# EAGLE design Universal-Sensor_Atmega328-v05 (EAGLE 7.3.0)
Assembly variants: Atmega + TH, P, L, Max (RF), Atmega + TH, P, MAX (RF), Atmega + TH, L, MAX (RF), Atmega + TH, MAX (RF), Atmega + TH, P, L, (Wired)
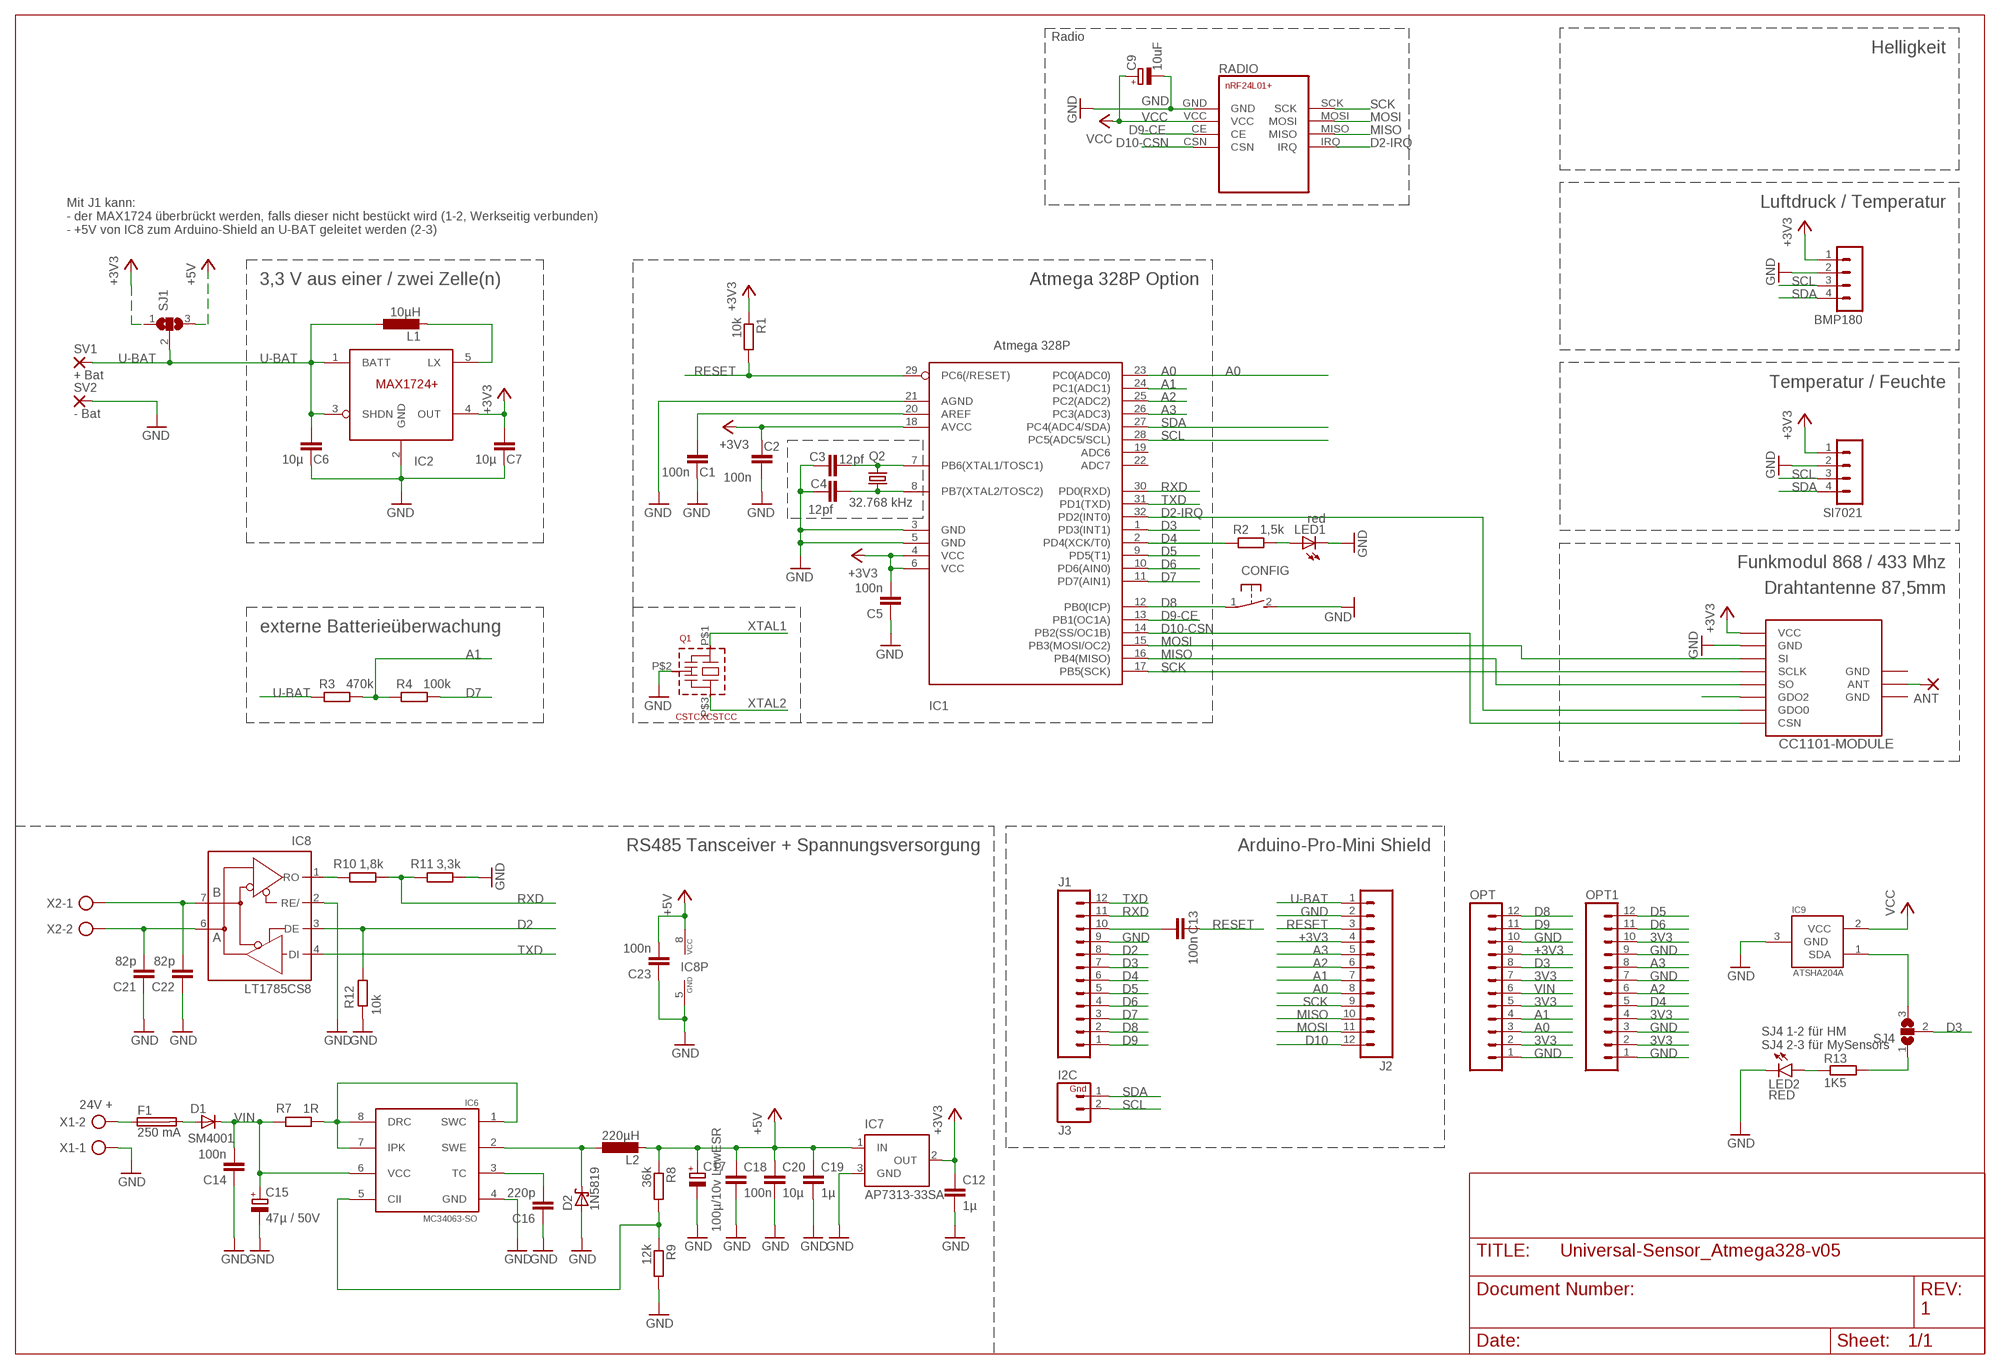
[diagram p0: schematic, sheet 1]

## Parts
ANT  1,6/0,8  [1,6/0,8]  (not fitted in variant Atmega + TH, P, L, (Wired))
BMP180  MA04-1  [MA04-1]
C1  100n  C-EUC0805  [C0805]
C2  100n  C-EUC0805  [C0805]
C3  12pf  C-EUC0805  [C0805]  (not fitted in variant Atmega + TH, P, L, Max (RF))  (not fitted in variant Atmega + TH, P, MAX (RF))  (not fitted in variant Atmega + TH, L, MAX (RF))  (not fitted in variant Atmega + TH, MAX (RF))  (not fitted in variant Atmega + TH, P, L, (Wired))
C4  12pf  C-EUC0805  [C0805]  (not fitted in variant Atmega + TH, P, L, Max (RF))  (not fitted in variant Atmega + TH, P, MAX (RF))  (not fitted in variant Atmega + TH, L, MAX (RF))  (not fitted in variant Atmega + TH, MAX (RF))  (not fitted in variant Atmega + TH, P, L, (Wired))
C5  100n  C-EUC0805  [C0805]
C6  10µ  C-EUC1206  [C1206]  (not fitted in variant Atmega + TH, P, L, (Wired))
C7  10µ  C-EUC1206  [C1206]  (not fitted in variant Atmega + TH, P, L, (Wired))
C9  10uF  CPOL-EUE2,5-6E  [E2,5-6E]
C12  1µ  C-EUC0805  [C0805]  (not fitted in variant Atmega + TH, P, L, Max (RF))  (not fitted in variant Atmega + TH, P, MAX (RF))  (not fitted in variant Atmega + TH, L, MAX (RF))  (not fitted in variant Atmega + TH, MAX (RF))
C13  100n  C-EUC0805  [C0805]
C14  100n  C-EUC1206  [C1206]  (not fitted in variant Atmega + TH, P, L, Max (RF))  (not fitted in variant Atmega + TH, P, MAX (RF))  (not fitted in variant Atmega + TH, L, MAX (RF))  (not fitted in variant Atmega + TH, MAX (RF))
C15  47µ / 50V  CPOL-EUE2.5-7  [E2,5-7]  (not fitted in variant Atmega + TH, P, L, Max (RF))  (not fitted in variant Atmega + TH, P, MAX (RF))  (not fitted in variant Atmega + TH, L, MAX (RF))  (not fitted in variant Atmega + TH, MAX (RF))
C16  220p  C-EUC0805  [C0805]  (not fitted in variant Atmega + TH, P, L, Max (RF))  (not fitted in variant Atmega + TH, P, MAX (RF))  (not fitted in variant Atmega + TH, L, MAX (RF))  (not fitted in variant Atmega + TH, MAX (RF))
C17  100µ/10v LowESR  CPOL-EUSMCD  [SMC_D]  (not fitted in variant Atmega + TH, P, L, Max (RF))  (not fitted in variant Atmega + TH, P, MAX (RF))  (not fitted in variant Atmega + TH, L, MAX (RF))  (not fitted in variant Atmega + TH, MAX (RF))
C18  100n  C-EUC0805  [C0805]  (not fitted in variant Atmega + TH, P, L, Max (RF))  (not fitted in variant Atmega + TH, P, MAX (RF))  (not fitted in variant Atmega + TH, L, MAX (RF))  (not fitted in variant Atmega + TH, MAX (RF))
C19  1µ  C-EUC0805  [C0805]  (not fitted in variant Atmega + TH, P, L, Max (RF))  (not fitted in variant Atmega + TH, P, MAX (RF))  (not fitted in variant Atmega + TH, L, MAX (RF))  (not fitted in variant Atmega + TH, MAX (RF))
C20  10µ  C-EUC1206  [C1206]  (not fitted in variant Atmega + TH, P, L, Max (RF))  (not fitted in variant Atmega + TH, P, MAX (RF))  (not fitted in variant Atmega + TH, L, MAX (RF))  (not fitted in variant Atmega + TH, MAX (RF))
C21  82p  C-EUC0805  [C0805]  (not fitted in variant Atmega + TH, P, L, Max (RF))  (not fitted in variant Atmega + TH, P, MAX (RF))  (not fitted in variant Atmega + TH, L, MAX (RF))  (not fitted in variant Atmega + TH, MAX (RF))
C22  82p  C-EUC0805  [C0805]  (not fitted in variant Atmega + TH, P, L, Max (RF))  (not fitted in variant Atmega + TH, P, MAX (RF))  (not fitted in variant Atmega + TH, L, MAX (RF))  (not fitted in variant Atmega + TH, MAX (RF))
C23  100n  C-EUC0805  [C0805]  (not fitted in variant Atmega + TH, P, L, Max (RF))  (not fitted in variant Atmega + TH, P, MAX (RF))  (not fitted in variant Atmega + TH, L, MAX (RF))  (not fitted in variant Atmega + TH, MAX (RF))
CC1101-MODULE  CC1101_WIRELES_MODULE  [CC1101_WIRELES_MODULE]  (not fitted in variant Atmega + TH, P, L, (Wired))
CONFIG  DTSM-3  [DTSM-3]
D1  SM4001  DIODE-MELF-MLL41  [MELF-MLL41]  (not fitted in variant Atmega + TH, P, L, Max (RF))  (not fitted in variant Atmega + TH, P, MAX (RF))  (not fitted in variant Atmega + TH, L, MAX (RF))  (not fitted in variant Atmega + TH, MAX (RF))
D2  1N5819  SCHOTTKY-DIODESMD  [SMB]  (not fitted in variant Atmega + TH, P, L, Max (RF))  (not fitted in variant Atmega + TH, P, MAX (RF))  (not fitted in variant Atmega + TH, L, MAX (RF))  (not fitted in variant Atmega + TH, MAX (RF))
F1  250 mA  SMD-MICRO-FUSE  [SMD-6,1X2,6]  (not fitted in variant Atmega + TH, P, L, Max (RF))  (not fitted in variant Atmega + TH, P, MAX (RF))  (not fitted in variant Atmega + TH, L, MAX (RF))  (not fitted in variant Atmega + TH, MAX (RF))
IC1  Atmega 328P  MEGA8-AI  [TQFP32-08]
IC2  MAX1724  [SOT23-5L]  (not fitted in variant Atmega + TH, P, L, (Wired))
IC6  MC34063-SO  [SO8]  (not fitted in variant Atmega + TH, P, L, Max (RF))  (not fitted in variant Atmega + TH, P, MAX (RF))  (not fitted in variant Atmega + TH, L, MAX (RF))  (not fitted in variant Atmega + TH, MAX (RF))
IC7  AP7313-33SA  MAX6520  [SOT23]  (not fitted in variant Atmega + TH, P, L, Max (RF))  (not fitted in variant Atmega + TH, P, MAX (RF))  (not fitted in variant Atmega + TH, L, MAX (RF))  (not fitted in variant Atmega + TH, MAX (RF))  (not fitted in variant Atmega + TH, P, L, (Wired))
IC8  LT1785CS8  MAX481CSA  [SO08]  (not fitted in variant Atmega + TH, P, L, Max (RF))  (not fitted in variant Atmega + TH, P, MAX (RF))  (not fitted in variant Atmega + TH, L, MAX (RF))  (not fitted in variant Atmega + TH, MAX (RF))
IC9  ATSHA204A  IC_ATSHA204A_CRYPT  [SOT23-3]
J1  M12PTH  [1X12]  (not fitted in variant Atmega + TH, P, L, Max (RF))  (not fitted in variant Atmega + TH, P, MAX (RF))  (not fitted in variant Atmega + TH, L, MAX (RF))  (not fitted in variant Atmega + TH, MAX (RF))  (not fitted in variant Atmega + TH, P, L, (Wired))
J2  M12PTH  [1X12]  (not fitted in variant Atmega + TH, P, L, Max (RF))  (not fitted in variant Atmega + TH, P, MAX (RF))  (not fitted in variant Atmega + TH, L, MAX (RF))  (not fitted in variant Atmega + TH, MAX (RF))  (not fitted in variant Atmega + TH, P, L, (Wired))
J3  I2C  M02PTH  [1X02]  (not fitted in variant Atmega + TH, P, L, Max (RF))  (not fitted in variant Atmega + TH, P, MAX (RF))  (not fitted in variant Atmega + TH, L, MAX (RF))  (not fitted in variant Atmega + TH, MAX (RF))  (not fitted in variant Atmega + TH, P, L, (Wired))
L1  10µH  L-EUL4532P  [L4532P]  (not fitted in variant Atmega + TH, P, L, (Wired))
L2  220µH  L-EUL5650M  [L5650M]  (not fitted in variant Atmega + TH, P, L, Max (RF))  (not fitted in variant Atmega + TH, P, MAX (RF))  (not fitted in variant Atmega + TH, L, MAX (RF))  (not fitted in variant Atmega + TH, MAX (RF))
LED1  red  LEDCHIP-LED0805  [CHIP-LED0805]
LED2  RED  LED-RED1206  [LED-1206]
OPT  M12PTH  [1X12]
OPT1  M12PTH  [1X12]
Q1  CSTCXCSTCC  [CSTCC]  (not fitted in variant Atmega + TH, P, L, Max (RF))  (not fitted in variant Atmega + TH, L, MAX (RF))  (not fitted in variant Atmega + TH, MAX (RF))  (not fitted in variant Atmega + TH, P, MAX (RF))
Q2  32.768 kHz  CRYSTALTC38H  [TC38H]  (not fitted in variant Atmega + TH, P, L, Max (RF))  (not fitted in variant Atmega + TH, P, MAX (RF))  (not fitted in variant Atmega + TH, L, MAX (RF))  (not fitted in variant Atmega + TH, MAX (RF))  (not fitted in variant Atmega + TH, P, L, (Wired))
R1  10k  R-EU_M0805  [M0805]
R2  1,5k  R-EU_M0805  [M0805]
R3  470k  R-EU_M0805  [M0805]  (not fitted in variant Atmega + TH, P, L, (Wired))
R4  100k  R-EU_M0805  [M0805]  (not fitted in variant Atmega + TH, P, L, (Wired))
R7  1R  R-EU_R0805  [R0805]  (not fitted in variant Atmega + TH, P, L, Max (RF))  (not fitted in variant Atmega + TH, P, MAX (RF))  (not fitted in variant Atmega + TH, L, MAX (RF))  (not fitted in variant Atmega + TH, MAX (RF))
R8  36k  R-EU_R0805  [R0805]  (not fitted in variant Atmega + TH, P, L, Max (RF))  (not fitted in variant Atmega + TH, P, MAX (RF))  (not fitted in variant Atmega + TH, L, MAX (RF))  (not fitted in variant Atmega + TH, MAX (RF))
R9  12k  R-EU_R0805  [R0805]  (not fitted in variant Atmega + TH, P, L, Max (RF))  (not fitted in variant Atmega + TH, P, MAX (RF))  (not fitted in variant Atmega + TH, L, MAX (RF))  (not fitted in variant Atmega + TH, MAX (RF))
R10  1,8k  R-EU_R0805  [R0805]  (not fitted in variant Atmega + TH, P, L, Max (RF))  (not fitted in variant Atmega + TH, P, MAX (RF))  (not fitted in variant Atmega + TH, L, MAX (RF))  (not fitted in variant Atmega + TH, MAX (RF))
R11  3,3k  R-EU_R0805  [R0805]  (not fitted in variant Atmega + TH, P, L, Max (RF))  (not fitted in variant Atmega + TH, P, MAX (RF))  (not fitted in variant Atmega + TH, L, MAX (RF))  (not fitted in variant Atmega + TH, MAX (RF))
R12  10k  R-EU_M0805  [M0805]  (not fitted in variant Atmega + TH, P, L, Max (RF))  (not fitted in variant Atmega + TH, P, MAX (RF))  (not fitted in variant Atmega + TH, L, MAX (RF))  (not fitted in variant Atmega + TH, MAX (RF))
R13  1K5  R0805_SMALL_GAP  [R0805_SMALL_GAP]
RADIO  NRF24L01+  [NRF24L01+]
SI7021  MA04-1  [MA04-1]
SJ1  SJ2W  [SJ_2]  (not fitted in variant Atmega + TH, P, L, Max (RF))  (not fitted in variant Atmega + TH, L, MAX (RF))  (not fitted in variant Atmega + TH, MAX (RF))  (not fitted in variant Atmega + TH, P, MAX (RF))
SJ4  SJ2W  [SJ_2]
SV1  + Bat  1,6/0,9  [1,6/0,9]  (not fitted in variant Atmega + TH, P, L, (Wired))
SV2  - Bat  1,6/0,9  [1,6/0,9]  (not fitted in variant Atmega + TH, P, L, (Wired))
X1  AK550/2  [AK550/2]  (not fitted in variant Atmega + TH, P, L, Max (RF))  (not fitted in variant Atmega + TH, P, MAX (RF))  (not fitted in variant Atmega + TH, L, MAX (RF))  (not fitted in variant Atmega + TH, MAX (RF))
X2  AK550/2  [AK550/2]  (not fitted in variant Atmega + TH, P, L, Max (RF))  (not fitted in variant Atmega + TH, P, MAX (RF))  (not fitted in variant Atmega + TH, L, MAX (RF))  (not fitted in variant Atmega + TH, MAX (RF))

## Nets
3V3: OPT1.2 OPT1.4 OPT1.10 OPT.2 OPT.5 OPT.7
+3V3 [vcc]: BMP180.1 C2.2 C5.2 C7.2 C12.1 CC1101-MODULE.VCC IC1.4(VCC) IC1.6(VCC) IC1.18(AVCC) IC2.4(OUT) IC7.2(OUT) J2.4 OPT.9 R1.1 SI7021.1 SJ1.1
+5V [vcc]: C17.+ C18.1 C19.1 C20.1 C23.2 IC7.1(IN) IC8.8(VCC) L2.2 R8.1 SJ1.3
A: C21.2 IC8.6(A) X2.2
A0: IC1.23(PC0(ADC0)) J2.8 OPT.3
A1: IC1.24(PC1(ADC1)) J2.7 OPT.4 R3.2 R4.1
A2: IC1.25(PC2(ADC2)) J2.6 OPT1.6
A3: IC1.26(PC3(ADC3)) J2.5 OPT1.8
ATSHA: IC9.1(SDA) SJ4.3
B: C22.2 IC8.7(B) X2.1
D2: IC8.3(DE) J1.8 R12.2
D2-IRQ: CC1101-MODULE.GDO0 IC1.32(PD2(INT0)) RADIO.IRQ
D3: IC1.1(PD3(INT1)) J1.7 OPT.8 SJ4.2
D4: IC1.2(PD4(XCK/T0)) J1.6 OPT1.5 R2.1
D5: IC1.9(PD5(T1)) J1.5 OPT1.12
D6: IC1.10(PD6(AIN0)) J1.4 OPT1.11
D7: IC1.11(PD7(AIN1)) J1.3 R4.2
D8: CONFIG.1 IC1.12(PB0(ICP)) J1.2 OPT.12
D9: J1.1 OPT.11
D9-CE: IC1.13(PB1(OC1A)) RADIO.CE
D10: J2.12
D10-CSN: CC1101-MODULE.CSN IC1.14(PB2(SS/OC1B)) RADIO.CSN
GND [power]: BMP180.2 C1.1 C2.1 C3.2 C4.2 C5.1 C6.1 C7.1 C9.- C12.2 C14.1 C15.- C16.1 C17.- C18.2 C19.2 C20.2 C21.1 C22.1 C23.1 CC1101-MODULE.GND@1(GND) CONFIG.2 D2.A IC1.3(GND) IC1.5(GND) IC1.21(AGND) IC2.2(GND) IC6.4(GND) IC7.3(GND) IC8.2(RE/) IC8.5(GND) IC9.3(GND) J1.9 J2.2 LED1.C LED2.C OPT1.1 OPT1.3 OPT1.7 OPT1.9 OPT.1 OPT.10 Q1.P$2(GND) R9.2 R11.1 R12.1 RADIO.GND SI7021.2 SV2.1(P) X1.1
LED: R13.2 SJ4.1
MISO: CC1101-MODULE.SO IC1.16(PB4(MISO)) J2.10 RADIO.MISO
MOSI: CC1101-MODULE.SI IC1.15(PB3(MOSI/OC2)) J2.11 RADIO.MOSI
N$1: C13.2 J1.10
N$2: IC2.5(LX) L1.2
N$3: CC1101-MODULE.GDO2
N$4: LED1.A R2.2
N$5: ANT.1(P) CC1101-MODULE.ANT
N$6: LED2.A R13.1
N$9 [vcc]: F1.1 X1.2
N$10: IC8.1(RO) R10.2
N$14: C1.2 IC1.20(AREF)
N$16 [vcc]: D1.A F1.2
N$17: IC6.1(SWC) IC6.7(IPK) IC6.8(DRC) R7.1
N$20: IC6.5(CII) R8.2 R9.1
N$21: C16.2 IC6.3(TC)
N$22 [vcc]: D2.C IC6.2(SWE) L2.1
RESET: C13.1 IC1.29(PC6(/RESET)) J2.3 R1.2
RXD: IC1.30(PD0(RXD)) J1.11 R10.1 R11.2
SCK: CC1101-MODULE.SCLK IC1.17(PB5(SCK)) J2.9 RADIO.SCK
SCL: BMP180.3 IC1.28(PC5(ADC5/SCL)) J3.2 SI7021.3
SDA: BMP180.4 IC1.27(PC4(ADC4/SDA)) J3.1 SI7021.4
TXD: IC1.31(PD1(TXD)) IC8.4(DI) J1.12
U-BAT [power]: C6.2 IC2.1(BATT) IC2.3(SHDN) J2.1 L1.1 R3.1 SJ1.2 SV1.1(P)
VCC: C9.+ IC9.2(VCC) RADIO.VCC
VIN [vcc]: C14.2 C15.+ D1.C IC6.6(VCC) OPT.6 R7.2
XTAL1: C3.1 IC1.7(PB6(XTAL1/TOSC1)) Q1.P$1 Q2.2
XTAL2: C4.1 IC1.8(PB7(XTAL2/TOSC2)) Q1.P$3 Q2.1
Unconnected: IC1.19(ADC6) IC1.22(ADC7)

## Notes on the sheet
- Radio
- Helligkeit
- Luftdruck / Temperatur
- Mit J1 kann:
  - der MAX1724 überbrückt werden, falls dieser nicht bestückt wird (1-2, Werkseitig verbunden)
  - +5V von IC8 zum Arduino-Shield an U-BAT geleitet werden (2-3)
- 3,3 V aus einer / zwei Zelle(n) | Atmega 328P Option
- Temperatur / Feuchte
- IC2
- Funkmodul 868 / 433 Mhz
- Drahtantenne 87,5mm
- externe Batterieüberwachung
- RS485 Tansceiver + Spannungsversorgung | Arduino-Pro-Mini Shield
- SJ4 1-2 für HM
  SJ4 2-3 für MySensors
- 24V +
- 1

## Power pins joined to a net without a drawn wire
GND: CC1101-MODULE.GND@2(GND) CC1101-MODULE.GND@3(GND)

## Library data of the parts
ANT = wirepad:1,6/0,8: THROUGH-HOLE PAD
BMP180 SI7021 = con-lstb:MA04-1: PIN HEADER; OC_FARNELL: unknown; OC_NEWARK: unknown
C1-C7 C12-C14 C16 C18-C23 = rcl:C-EU: CAPACITOR, European symbol
C9 C15 C17 = rcl:CPOL-EU: POLARIZED CAPACITOR, European symbol
CC1101-MODULE = untitled:CC1101_WIRELES_MODULE
CONFIG = switch-tact:DTSM-3
D1 = diode:DIODE-: DIODE
D2 = diode:SCHOTTKY-DIODE: Schottky Diode
F1 = f-lf-omniblok-s:SMD-MICRO-FUSE
IC1 = atmel:MEGA8: MICROCONTROLLER 8 Kbytes FLASH 1 kbytes SRAM 512 bytes EEPROM USART 6-channel 10 bit ADC 2-channel 8 bit ADC
IC2 = MAX1724:MAX1724
IC6 = mc34063:MC34063-SO: DC/DC converter MC34063 in SO08.
IC7 = maxim:MAX6520: 1.2V Voltage Reference 50ppm/°C, SOT23, 3-Terminal Source: Data sheet <http://datasheets.maxim-ic.com/en/ds/MAX6520.pdf>; MF: MAXIM; MPN: MAX6520EUR-T; OC_FARNELL: unknown; OC_NEWARK: 02J4586
IC8 = maxim:MAX481CSA: RS485 TRANSEIVER; MF: MAXIM; MPN: MAX481CSA; OC_FARNELL: unknown; OC_NEWARK: 90C3817
IC9 = MySensors:IC_ATSHA204A_CRYPT
J1 J2 OPT OPT1 = SparkFun:M12: Header 12 Standard 12-pin 0.1" header. Use with straight break away headers (SKU : PRT-00116), right angle break away headers (PRT-00553), swiss pins (PRT-00743), machine pins (PRT-00117), and female headers (PRT-00115).
J3 = SparkFun:M02: Header 2 Standard 2-pin 0.1" header. Use with straight break away headers (SKU : PRT-00116), right angle break away headers (PRT-00553), swiss pins (PRT-00743), machine pins (PRT-00117), and female headers (PRT-00115). Molex polarized connector foot print use with SKU : PRT-08233 with associated crimp pins and housings.
L1 L2 = rcl:L-EU: INDUCTOR, European symbol
LED1 = led:LED: LED OSRAM: - CHIPLED LG R971, LG N971, LY N971, LG Q971, LY Q971, LO R971, LY R971 LH N974, LH R974 LS Q976, LO Q976, LY Q976 LO Q996 - Hyper CHIPLED LW Q18S LB Q993, LB Q99A, LB R99A - SideLED LS A670, LO A670, LY A670, LG A670, LP A670 LB A673, LV A673, LT A673, LW A673 LH A674 LY A675 LS A676, LA A676, LO A676, LY A676, LW A676 LS A679, LY A679, LG A679 - Hyper Micro SIDELED® LS Y876, LA Y876, LO Y876, LY Y876 LT Y87S - SmartLED LW L88C, LW L88S LB L89C, LB L89S, LG L890 LS L89K, LO L89K, LY L89K LS L896, LA L896, LO L896, LY L896 - TOPLED LS T670, LO T670, LY T670, LG T670, LP T670 LSG T670, LSP T670, LSY T670, LOP T670, LYG T670 LG T671, LOG T671, LSG T671 LB T673, LV T673, LT T673, LW T673 LH T674 LS T676, LA T676, LO T676, LY T676, LB T676, LH T676, LSB T676, LW T676 LB T67C, LV T67C, LT T67C, LS T67K, LO T67K, LY T67K, LW E67C LS E67B, LA E67B, LO E67B, LY E67B, LB E67C, LV E67C, LT E67C LW T67C LS T679, LY T679, LG T679 LS T770, LO T770, LY T770, LG T770, LP T770 LB T773, LV T773, LT T773, LW T773 LH T774 LS E675, LA E675, LY E675, LS T675 LS T776, LA T776, LO T776, LY T776, LB T776 LHGB T686 LT T68C, LB T68C - Hyper Mini TOPLED® LB M676 - Mini TOPLED Santana® LG M470 LS M47K, LO M47K, LY M47K Source: http://www.osram.convergy.de LUXEON: - LUMILED® LXK2-PW12-R00, LXK2-PW12-S00, LXK2-PW14-U00, LXK2-PW14-V00 LXK2-PM12-R00, LXK2-PM12-S00, LXK2-PM14-U00 LXK2-PE12-Q00, LXK2-PE12-R00, LXK2-PE12-S00, LXK2-PE14-T00, LXK2-PE14-U00 LXK2-PB12-K00, LXK2-PB12-L00, LXK2-PB12-M00, LXK2-PB14-N00, LXK2-PB14-P00, LXK2-PB14-Q00 LXK2-PR12-L00, LXK2-PR12-M00, LXK2-PR14-Q00, LXK2-PR14-R00 LXK2-PD12-Q00, LXK2-PD12-R00, LXK2-PD12-S00 LXK2-PH12-R00, LXK2-PH12-S00 LXK2-PL12-P00, LXK2-PL12-Q00, LXK2-PL12-R00 Source: www.luxeon.com KINGBRIGHT: KA-3528ASYC Source: www.kingbright.com
LED2 = SparkFun-LED:LED-RED: Assorted Red LEDs LilyPad 1206- DIO-09912 1206- DIO-00809 0603- DIO-00819 "SMART" means more efficient and expensive; PROD_ID: DIO-09912
Q1 = murata-cstcc-cstcv-resonators:CSTCX
Q2 = crystal:CRYSTAL: CRYSTAL; OC_FARNELL: unknown; OC_NEWARK: unknown
R1-R4 R7-R12 = rcl:R-EU_: RESISTOR, European symbol
R13 = Hexenmeister:R0805_SMALL_GAP: SMD Resistor (0805) mit einer schmalleren Lücke (kann als Lötjumper erwendet werden)
RADIO = my:NRF24L01+: nRF24L01+ Transceiver Module
SJ1 SJ4 = jumper:SJ2W: SMD solder JUMPER
SV1 SV2 = wirepad:1,6/0,9: THROUGH-HOLE PAD
X1 X2 = con-ptr500:AK550/2: CONNECTOR; OC_FARNELL: unknown; OC_NEWARK: unknown

## Net classes
0 default: width 0.203 mm
1 vcc: width 0.305 mm
2 power: width 0.406 mm

## Board
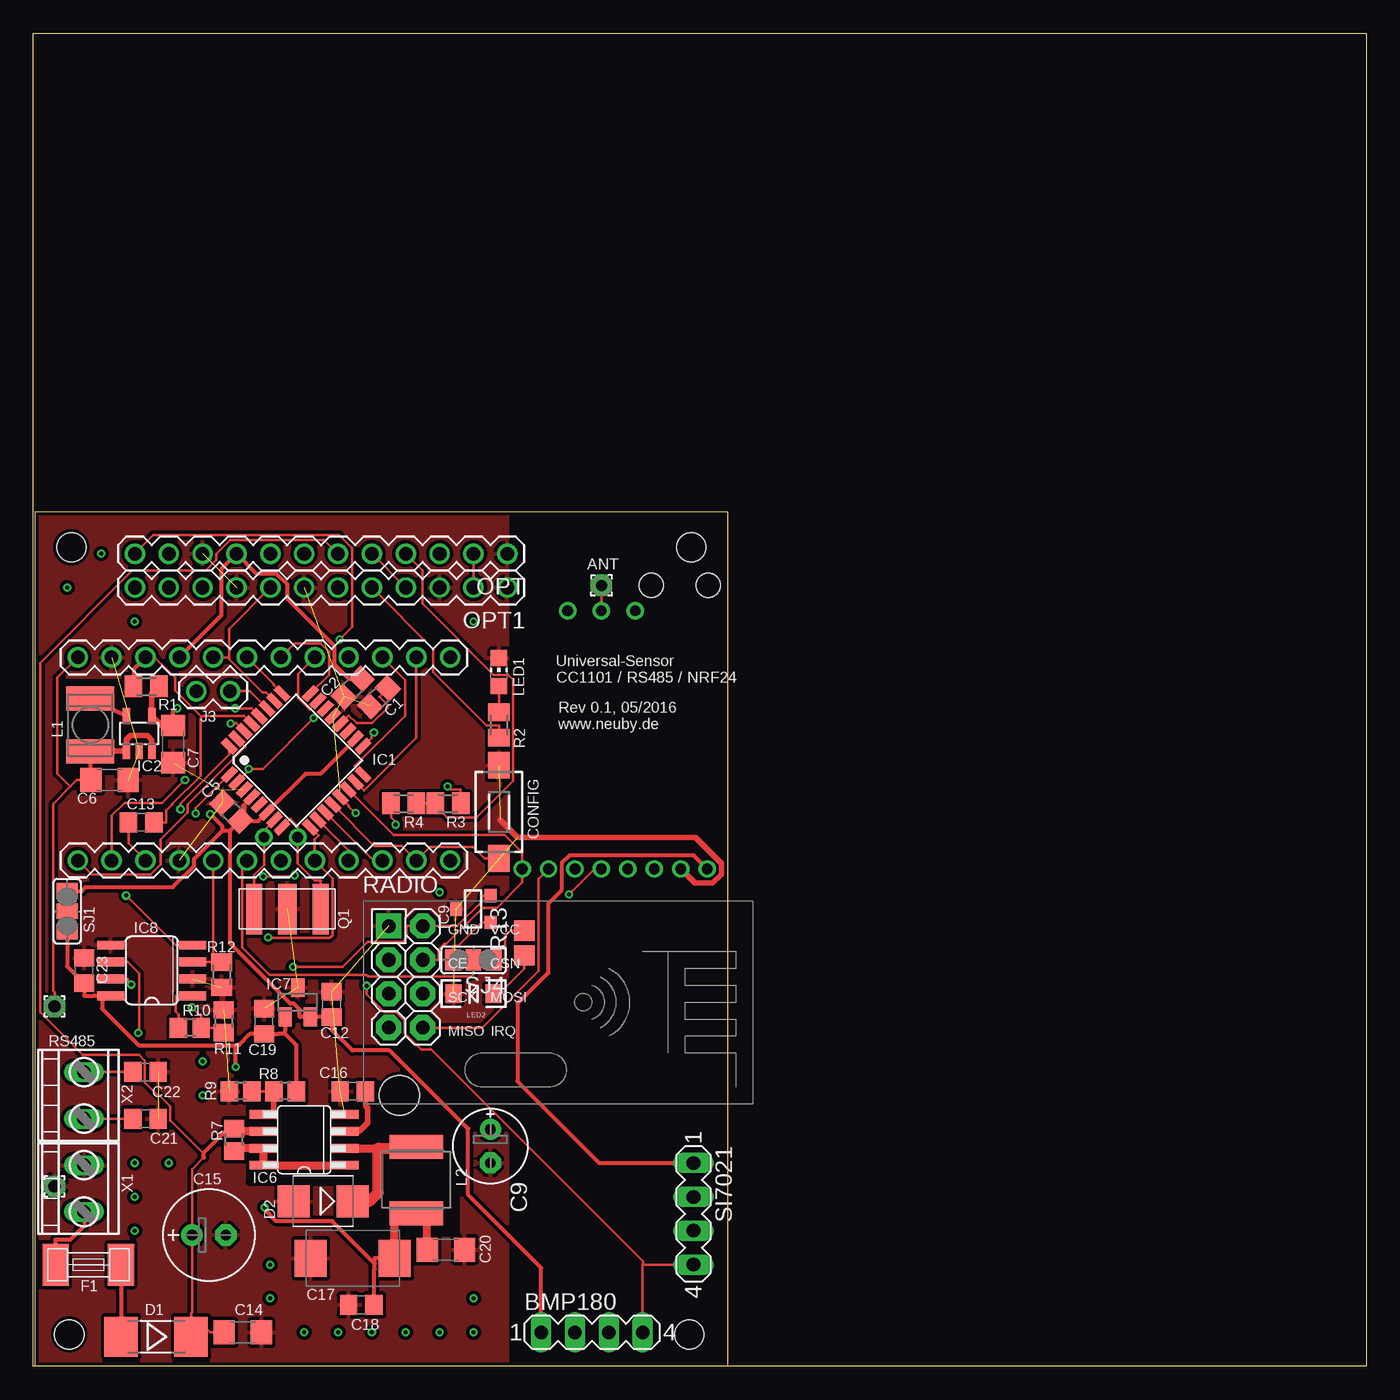
[diagram p1: board, top side]
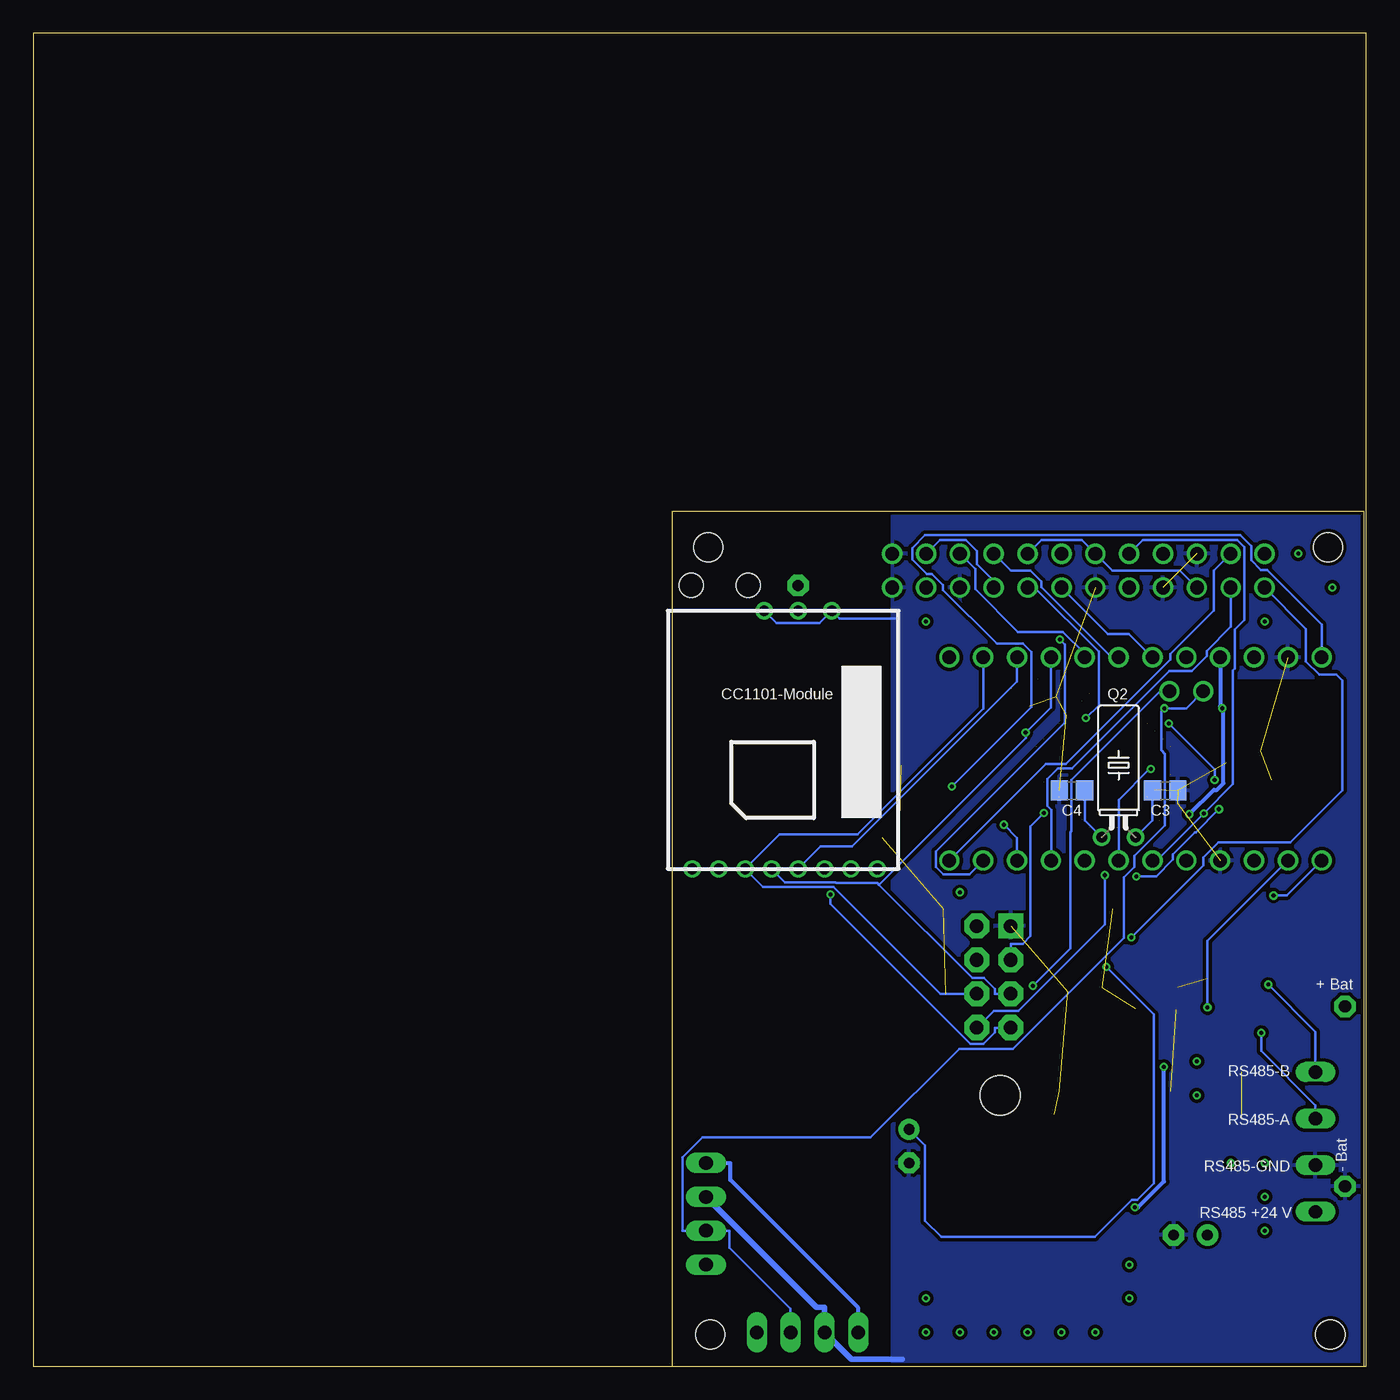
[diagram p2: board, bottom side, seen from below]

Size 100 x 100 mm. Coordinates in mm from the lower left corner, seen from the top.
Outline: 0.16,0 0.16,64.14 52.07,64.14 52.07,0 0.16,0
Outline: 0,50 0,100 100,100 100,0 0,0 0,50
Copper layers (1*16): Top 0.035mm / dielectric 1.5mm / Bottom 0.035mm
Design rules "ITEADstudio_DRC": minimum track width 6mil, minimum drill 12mil, track to track 6mil, track to pad 6mil, pad to pad 6mil, via to via 6mil, smd to smd 0mil, copper to edge 10mil, drill to drill 10mil, minimum pad ring 10mil, minimum via ring 6mil, stop-mask expansion 2mil, vias tented up to drill 100mil, thermal gap 10mil
Holes 2.2 mm at 2.7,2.38 49.21,2.38 2.86,61.44 49.37,61.44
Holes 1.8 mm at 46.35,58.58 50.64,58.58
Holes 3 mm at 27.46,20.32
tRestrict: area 2.1,44.6 to 9.8,51.3; area 16.2,13.8 to 24.3,19.2; area 24.4,10 to 31.8,18.1; area 36.8,19.1 to 52.1,34.3; area 38.1,40.6 to 52.1,54.6
bRestrict: area 2.1,43.3 to 9.7,51.3; area 16.2,13.8 to 24.3,19.2; area 24.4,10 to 31.8,18.1; area 24.2,17.1 to 30.7,23.6; area 36.8,19.1 to 52.1,34.3; area 38.1,40.6 to 52.1,54.6

### Footprints (pad centres in the part's own frame; a part is rotated, then mirrored left to right if it is on the bottom)
1,6/0,8 = drill 0.813 pad 1.6 octagon: 1 0,0
MA04-1 = drill 1.016 long: 1 -3.81,0; 2 -1.27,0; 3 1.27,0; 4 3.81,0
C0805 = smd 1.3 x 1.5: 1 -0.95,0; 2 0.95,0
C1206 = smd 1.6 x 1.8: 1 -1.4,0; 2 1.4,0
E2,5-6E = drill 0.813 pad 1.575: + -1.27,0 | drill 0.813 pad 1.575 octagon: - 1.27,0
E2,5-7 = drill 0.813 pad 1.6: + -1.27,0 | drill 0.813 pad 1.6 octagon: - 1.27,0
SMC_D = smd 2.4 x 2.8: + -3.15,0; - 3.15,0
CC1101_WIRELES_MODULE = drill 0.8: ANT 19.367,7.541; CSN 0,1.587; GDO0 0,3.572; GDO2 0,5.556; GND@1 0,13.494; GND@2 19.367,10.081; GND@3 19.367,5.001; SCLK 0,9.525; SI 0,11.509; SO 0,7.541; VCC 0,15.478
DTSM-3 = smd 2 x 1.6: 1 -3.494,0; 2 3.494,0
MELF-MLL41 = smd 2.5 x 3: A 2.625,0; C -2.625,0
SMB = smd 2.4 x 2.4: A 2.2,0; C -2.2,0
SMD-6,1X2,6 = smd 1.96 x 3.15: 1 -2.45,0; 2 2.45,0
TQFP32-08 = smd 1.27 x 0.559: 1 -4.293,2.8; 2 -4.293,2; 3 -4.293,1.2; 4 -4.293,0.4; 5 -4.293,-0.4; 6 -4.293,-1.2; 7 -4.293,-2; 8 -4.293,-2.8; 17 4.293,-2.8; 18 4.293,-2; 19 4.293,-1.2; 20 4.293,-0.4; 21 4.293,0.4; 22 4.293,1.2; 23 4.293,2; 24 4.293,2.8 | smd 0.559 x 1.27: 9 -2.8,-4.293; 10 -2,-4.293; 11 -1.2,-4.293; 12 -0.4,-4.293; 13 0.4,-4.293; 14 1.2,-4.293; 15 2,-4.293; 16 2.8,-4.293; 25 2.8,4.293; 26 2,4.293; 27 1.2,4.293; 28 0.4,4.293; 29 -0.4,4.293; 30 -1.2,4.293; 31 -2,4.293; 32 -2.8,4.293
SOT23-5L = smd 0.55 x 1.2: 1 -0.95,-1.3; 2 0,-1.3; 3 0.95,-1.3; 4 0.95,1.3; 5 -0.95,1.3
SO8 = smd 0.66 x 2.032: 1 -1.905,-3.073; 2 -0.635,-3.073; 3 0.635,-3.073; 4 1.905,-3.073; 5 1.905,3.073; 6 0.635,3.073; 7 -0.635,3.073; 8 -1.905,3.073
SOT23 = smd 1 x 1.4: 1 -0.95,-1.1; 2 0.95,-1.1; 3 0,1.1
SO08 = smd 0.66 x 2.032: 1 -1.905,-3.073; 2 -0.635,-3.073; 3 0.635,-3.073; 4 1.905,-3.073; 5 1.905,3.073; 6 0.635,3.073; 7 -0.635,3.073; 8 -1.905,3.073
SOT23-3 = smd 1 x 0.9: 1 -1,-1.3; 2 1,-1.3; 3 0,1.3
1X12 = drill 1.016: 1 0,0; 2 2.54,0; 3 5.08,0; 4 7.62,0; 5 10.16,0; 6 12.7,0; 7 15.24,0; 8 17.78,0; 9 20.32,0; 10 22.86,0; 11 25.4,0; 12 27.94,0
1X02 = drill 1.016: 1 0,0; 2 2.54,0
L4532P = smd 1.8 x 3.6: 1 -2,0; 2 2,0
L5650M = smd 1.8 x 4: 1 -2.5,0; 2 2.5,0
CHIP-LED0805 = smd 1.2 x 1.2: A 0,-1.05; C 0,1.05
LED-1206 = smd 1.2 x 1.4: A -1.5,0; C 1.5,0
CSTCC = smd 1.2 x 3.8: P$1 -2.5,0; P$3 2.5,0 | smd 1.4 x 3.8: P$2 0,0
TC38H = drill 0.813: 1 -1.27,0; 2 1.27,0
M0805 = smd 1.3 x 1.6: 1 -0.95,0; 2 0.95,0
R0805 = smd 1.3 x 1.5: 1 -0.85,0; 2 0.85,0
R0805_SMALL_GAP = smd 1.524 x 1.524: 1 -0.927,0; 2 0.927,0
NRF24L01+ = drill 1.016 pad 1.88 octagon: CE -11.43,1.27; CSN -8.89,1.27; IRQ -8.89,-3.81; MISO -11.43,-3.81; MOSI -8.89,-1.27; SCK -11.43,-1.27; VCC -8.89,3.81 | drill 1.016 pad 1.88 square: GND -11.43,3.81
SJ_2 = smd 1.168 x 1.6: 1 -1.524,0; 2 0,0; 3 1.524,0
1,6/0,9 = drill 0.914 pad 1.6 octagon: 1 0,0
AK550/2 = drill 1 pad 1.5 long: 1 -1.75,0; 2 1.75,0

### Placement (x,y rotation side)
ANT  42.62,58.58 0 top
BMP180  41.91,2.54 0 top
C1  25.94,50.19 45 top
C2  23.96,50.9 45 top
C3  15.08,43.18 0 bottom
C4  22.07,43.18 180 bottom
C5  14.85,41.6 315 top
C6  5.71,43.97 180 top
C7  10.48,46.67 90 top
C9  34.29,16.51 270 top
C12  22.38,27.15 90 top
C13  8.1,40.8 180 top
C14  15.72,2.54 180 top
C15  13.18,9.84 0 top
C16  23.97,20.64 0 top
C17  23.97,8.1 180 top
C18  24.61,4.6 180 top
C19  17.3,25.88 90 top
C20  30.96,8.73 0 top
C21  8.41,18.57 180 top
C22  8.41,22.07 180 top
C23  3.81,29.69 270 top
CC1101-MODULE  35.08,37.31 90 bottom
CONFIG  34.92,41.59 90 top
D1  9.21,2.22 180 top
D2  21.75,12.38 180 top
F1  4.13,7.62 0 top
IC1  19.72,45.45 45 top
IC2  7.94,47.47 0 top
IC6  20.32,16.99 90 top
IC7  19.84,27.3 0 top
IC8  8.89,29.69 90 top
IC9  33.02,34.29 90 top
J1  31.27,37.94 180 top
J2  3.33,53.18 0 top
J3  14.76,50.64 180 top
L1  4.29,48.1 90 top
L2  28.73,13.97 270 top
LED1  34.92,52.07 0 top
LED2  33.02,27.94 180 top
OPT  35.56,60.96 180 top
OPT1  35.56,58.42 180 top
Q1  19.05,34.29 0 top
Q2  18.57,39.69 0 bottom
R1  8.47,51 180 top
R2  34.92,48.1 90 top
R3  31.11,42.23 180 top
R4  27.78,42.23 180 top
R7  15.08,16.99 90 top
R8  18.89,20.64 180 top
R9  15.56,20.64 180 top
R10  11.75,25.4 180 top
R11  14.29,25.88 270 top
R12  14.13,29.37 90 top
R13  36.83,31.75 90 top
RADIO  38.1,29.21 0 top
SI7021  49.53,11.43 270 top
SJ1  2.54,34.13 270 top
SJ4  33.02,30.48 180 top
SV1  1.59,26.99 0 top
SV2  1.59,13.49 0 top
X1  3.81,13.34 270 top
X2  3.81,20.32 270 top

### Tracks (layer width: path | path; a pad name or v marks a point on that pad's centre or on a via)
3V3
  Top 0.203: OPT.5 OPT1.4 | OPT.2 OPT1.2
  Bottom 0.203: OPT1.4 27.94,58.92 29.21,60.19 29.21,61.17 30.02,61.99 31.99,61.99 OPT.2 | OPT1.10 13.97,59.69 19.05,59.69 OPT.7 21.34,61.98 24.38,61.98 OPT.5
+3V3  (via drill 0.3 pad 0.61)  (6 unrouted)
  Top 0.305: CC1101-MODULE.VCC 49.54,38.33 40.24,38.33 39.65,37.74 39.65,35.71 38.62,34.68 38.62,29.5 36.32,27.2 36.32,21.37 42.45,15.24 SI7021.1 | C2.2 23.71,51.57 22.59,52.7 22.59,54.06 19.05,57.6 19.05,58.67 18.23,59.49 16.71,59.49 OPT.9 14.12,59.84 14.12,56.35 J2.4 | 15.86,40.9 15.86,41.92 15.74,42.03 IC1.4 | 15.86,40.9 15.86,40.59 C5.2 14.78,40.18 | 15.86,40.9 16.87,40.9 | 16.87,40.9 | 16.87,40.9 IC1.6 20.42,44.45 21.55,44.45 IC1.18 | 14.78,40.18 | 14.2,40.18 14.78,40.18 | 14.78,40.18 14.78,31.71 19.27,27.21 19.53,27.21 19.99,26.75 19.99,26.2 IC7.2 21.32,26.2 21.33,26.2 C12.1 22.38,25.24 23.94,23.69 26.74,23.69 32.62,17.81 32.62,12.85 38.1,7.37 BMP180.1 | SJ1.1 3.65,35.66 3.93,35.94 10.46,35.94 12.06,37.54 12.06,38.04 14.2,40.18 | 14.2,40.18 14.2,40.48 v13.26,41.41 | v10.79,49.36 10.6,49.18 10.48,49.18 C7.2 9.58,48.07
  Top 0.406: IC2.4 8.89,50.47 R1.1 | 9.58,48.07 IC2.4 | IC2.4
  Bottom 0.305: v13.26,41.41 11.43,43.24 11.19,43.24 10.7,43.73 10.7,49.28 v10.79,49.36 10.95,49.53 J2.4 | SI7021.1 47.7,15.24 47.7,13.97 38.1,4.37 BMP180.1
+5V  (via drill 0.3 pad 0.61)
  Top 0.305: 15.17,24.07 15.39,24.07 16.25,24.93 C19.1 18.36,24.93 18.89,24.93 | 5.16,27.78 5.16,26.81 7.9,24.07 15.17,24.07 | v15.17,22.46 15.17,24.07 | 25.62,7.68 22.42,10.88 18.22,10.88 17.34,11.76 v17.34,11.91 | 25.62,7.68 25.62,8.1 C17.+ | 25.62,7.68 25.62,7.27 25.56,7.21 25.56,5.66 C18.1 | 18.89,24.93 18.89,25.2 IC7.1 | R8.1 19.74,24.08 18.89,24.93 | 5.16,27.78 4.5,27.78 | IC8.8 5.16,27.78 | 4.5,27.78 3.81,27.78 C23.2 2.54,30.01 SJ1.3 | 4.5,27.78
  Top 0.61: C17.+ | C17.+ 27.12,11.25 27.3,11.43 28.54,11.43 | 28.54,11.43 28.69,11.43 L2.2 | C20.1 29.56,10.99 29.38,11.18 28.54,11.4 28.54,11.43
  Bottom 0.305: v17.34,11.91 17.12,11.91 15.17,13.86 v15.17,22.46
A  (via drill 0.3 pad 0.61)
  Top 0.203: C21.2 6.56,18.57 X2.2 | IC8.6 7.09,30.32 7.95,29.46 7.95,25.09 v7.88,25.01
  Bottom 0.203: X2.2 3.81,19.58 7.88,23.64 v7.88,25.01
A0  (1 unrouted)
  Top 0.203: IC1.23 20.72,49.27 19.86,50.13 19.86,51.93 J2.8
  Bottom 0.203: OPT.3 29.34,59.82 29.34,58.3 26.12,55.09 22.75,55.09 21.11,53.46 J2.8
A1  (1 unrouted)
  Top 0.203: 30,42.23 31.06,41.17 33.24,41.17 35.98,43.91 35.98,51.52 35.63,51.87 34.54,51.87 29.21,57.21 29.21,59.69 OPT.4 | R3.2 30,42.23 | 30,42.23 29.26,42.23 R4.1 | J2.7 19.62,54.22 21.57,54.22 22.18,53.61 22.18,51.87 IC1.24
  Bottom 0.203: J2.7 19.1,53.18 24.38,58.47 24.38,58.88 25.2,59.69 26.67,59.69 OPT.4
A2  (1 unrouted)
  Top 0.203: IC1.25 18.04,51.1 18.04,51.18 J2.6
  Bottom 0.203: OPT1.6 19.38,54.94 17.79,54.94 J2.6
A3  (1 unrouted)
  Top 0.203: 14.68,53.18 14.68,53.04 17.19,50.53 17.47,50.53 | 17.47,50.53 | OPT1.8 14.68,55.32 14.68,53.18 | 14.68,53.18 J2.5 | IC1.26 17.47,50.53
ATSHA
  Top 0.203: IC9.1 33.62,33.29 31.86,31.53 31.5,31.53 SJ4.3
B  (via drill 0.3 pad 0.61)
  Top 0.203: C22.2 6.56,22.07 X2.1 | IC8.7 7.09,29.05 7.09,28.88 v7.34,28.63
  Bottom 0.203: X2.1 3.81,25.1 v7.34,28.63
D2
  Top 0.203: 13.49,30.32 13.5,30.32 R12.2 | J1.8 13.49,30.32 | 13.49,30.32 13.23,30.32 IC8.3
D2-IRQ  (via drill 0.3 pad 0.61)  (2 unrouted)
  Top 0.203: RADIO.IRQ 33.65,25.4 37.91,29.65 37.91,36.55 CC1101-MODULE.GDO0 | v17.23,36.75 19.51,36.75 v19.6,36.84 | IC1.32 14.71,45.9 11.04,42.23 v11.04,41.79 | v11.04,41.79
  Bottom 0.203: v19.6,36.84 19.6,33.16 26.08,26.67 27.94,26.67 RADIO.IRQ | v11.04,41.79 12.77,40.06 12.85,40.06 14.51,38.4 14.51,38 15.76,36.75 v17.23,36.75
D3  (via drill 0.3 pad 0.61)  (1 unrouted)
  Top 0.203: v12.19,41.47 12.19,41.88 IC1.1 | J1.7 15.67,37.58 15.67,31.41 17.72,29.37 24.99,29.37 25.1,29.25 32.85,29.25 33.02,29.43 SJ4.2
  Bottom 0.203: OPT.8 16.76,61.98 9.67,61.98 9.14,61.45 9.14,55.99 9.85,55.28 9.85,52.34 9.99,52.2 9.99,43.66 v12.19,41.47 15.71,37.94 J1.7
D4  (via drill 0.3 pad 0.61)  (1 unrouted)
  Top 0.203: R2.1 34.92,48.05 34.02,48.05 30,52.07 30,53.82 OPT1.5 | v21.03,48.62 17.23,44.82 v16.15,44.82 16.15,44.71 IC1.2
  Bottom 0.203: OPT1.5 24.88,58.42 20.07,53.61 20.07,49.58 v21.03,48.62 | J1.6 18.57,42.5 16.25,44.82 v16.15,44.82
D5  (via drill 0.3 pad 0.61)  (1 unrouted)
  Top 0.203: v17.62,32.18 17.68,32.12 22.24,32.12 22.45,32.33 22.45,36.61 J1.5 21.11,39.51 21.41,39.81 IC1.9
  Bottom 0.203: OPT1.12 4.52,55.32 4.52,52.88 3.52,51.89 2.24,51.89 1.81,51.46 1.81,43.18 5.7,39.28 11.09,39.28 12.22,38.15 12.22,37.57 v17.62,32.18
D6  (1 unrouted)
  Top 0.203: J1.4 23.65,38.69 IC1.10
  Bottom 0.203: OPT1.11 10.16,55.48 11.97,53.67 11.97,53.27 13.09,52.14 14.77,52.14 22.08,44.83 23.15,44.83 23.93,44.04 23.93,42.03 23.63,41.73 23.63,37.97 J1.4
D7  (via drill 0.3 pad 0.61)  (1 unrouted)
  Top 0.203: J1.3 25.54,37.94 IC1.11 | R4.2 26.83,41.17 27.17,40.83 v27.17,40.63
  Bottom 0.203: v27.17,40.63 26.19,39.65 J1.3
D8  (via drill 0.3 pad 0.61)  (2 unrouted)
  Top 0.203: IC1.12 25.57,39.04 27.64,39.04 J1.2 29.76,38.97 33,38.97 33.87,38.1 CONFIG.1 | OPT.12 9.01,62.35 22.94,62.35 23.91,61.37 23.91,55.47 v22.98,54.53
  Bottom 0.203: v22.98,54.53 22.61,54.16 22.61,48.28 32.29,38.6 32.29,37.48 31.7,36.89 29.79,36.89 J1.2
D9
  Bottom 0.203: OPT.11 11.43,59.69 11.43,56.69 14.68,53.43 14.68,53.02 22.52,45.18 24.03,45.18 J1.1
D9-CE  (via drill 0.3 pad 0.61)  (1 unrouted)
  Top 0.203: IC1.13 23.67,42.07 23.67,42.01 v24.19,41.5
  Bottom 0.203: RADIO.CE 26.67,31.67 25.77,31.67 25.18,32.27 25.18,40.51 v24.19,41.5
D10-CSN  (1 unrouted)
  Top 0.203: IC1.14 27.03,39.84 35.37,39.84 36.67,38.55 CC1101-MODULE.CSN 36.67,36.28 34.79,34.4 33.69,34.4 30.97,31.67 30.83,31.67 30.4,31.25 30.4,30.48 RADIO.CSN
GND  (25 unrouted)
  Top 0.406: 35.01,40.99 36.34,39.66 49.7,39.66 51.63,37.72 51.63,36.91 50.97,36.25 49.64,36.25 CC1101-MODULE.GND@1
  Bottom 0.203: CC1101-MODULE.GND@2 44.24,55.75 41.01,55.75 CC1101-MODULE.GND@3 39.52,56.11 35.24,56.11
  Bottom 0.406: SI7021.2 41.25,4.42 40.64,4.42 BMP180.2 38.61,0.51 34.78,0.51
  pour Bottom (isolate 0.254): 0,0 0.16,64.93 35.56,64.93 35.56,0
  pour Top (isolate 0.254): 0,0 0,64.93 35.56,64.93 35.56,0
LED
  Top 0.203: R13.2 35.81,32.68 35.38,32.24 35.38,30.48 SJ4.1
MISO  (via drill 0.3 pad 0.61)  (3 unrouted)
  Top 0.203: v40.2,35.4 42.11,37.31 CC1101-MODULE.SO | IC1.16 24.11,45.03 27.88,48.79 27.88,51.5 J2.10
  Bottom 0.203: RADIO.MISO 27.86,25.4 27.86,25.03 28.71,24.18 29.68,24.18 40.2,34.69 v40.2,35.4 | J2.10 26.19,51.37 38.58,38.98 40.95,38.98 CC1101-MODULE.SO
MOSI  (2 unrouted)
  Top 0.203: IC1.15 24.8,43.2 28.73,47.13 J2.11
  Bottom 0.203: J2.11 28.73,49.34 38.18,39.89 44.01,39.89 CC1101-MODULE.SI 45.24,35.95 39.96,35.95 31.95,27.94 30.4,27.94 RADIO.MOSI
N$1
  Top 0.203: J1.10 7.15,39.21 C13.2
N$2
  Top 0.305: L1.2 IC2.5
N$4
  Top 0.203: R2.2 LED1.A
N$5  (1 unrouted)
  Top 0.203: CC1101-MODULE.ANT ANT.1
N$6
  Top 0.203: LED2.A 35.37,27.94 35.37,28.35 36.83,29.81 R13.1
N$7  (via drill 0.3 pad 0.61)
  other vias: 33.02,2.54
N$8  (via drill 0.3 pad 0.61)
  other vias: 30.48,2.54
N$9
  Top 0.305: F1.1 1.68,9.5 2.78,9.5 3.81,10.53 X1.2
N$10
  Top 0.203: R10.2 10.9,26.4 10.69,26.61 10.69,27.78 IC8.1
N$11  (via drill 0.3 pad 0.61)
  other vias: 27.94,2.54
N$12  (via drill 0.3 pad 0.61)
  other vias: 25.4,2.54
N$13  (via drill 0.3 pad 0.61)
  other vias: 22.86,2.54
N$14  (2 unrouted)
  Top 0.203: C1.2 25.97,50.22 26.58,49.62 26.58,49.38 25.44,48.24 24.26,48.24 23.67,48.83 IC1.20
N$15  (via drill 0.3 pad 0.61)
  other vias: 20.32,2.54
N$16
  Top 0.305: F1.2 6.58,5.74 D1.A
N$17
  Top 0.406: 15.3,16.35 R7.1
  Top 0.61: IC6.1 IC6.8 IC6.7 15.3,16.35
N$18  (via drill 0.3 pad 0.61)
  other vias: 17.78,5.08
N$19  (via drill 0.3 pad 0.61)
  other vias: 17.78,7.62
N$20
  Top 0.203: R9.1 R8.2 | R8.2
  Top 0.406: R8.2 18.04,18.99 17.94,18.89 IC6.5
N$21
  Top 0.406: C16.2 24.92,19.53 25.08,19.37 25.08,18.26 24.45,17.62 IC6.3
N$22
  Top 0.61: 27.34,16.35 L2.1 | IC6.2 25.88,16.35
  Top 0.813: D2.C 25.24,12.38 25.88,13.02 25.88,16.35 27.34,16.35
N$23  (via drill 0.3 pad 0.61)
  other vias: 7.62,10.16
N$24  (via drill 0.3 pad 0.61)
  other vias: 7.62,12.7
N$25  (via drill 0.3 pad 0.61)
  other vias: 7.62,15.24
N$26  (via drill 0.3 pad 0.61)
  other vias: 10.16,15.24
N$27  (via drill 0.3 pad 0.61)
  other vias: 2.54,58.42
N$28  (via drill 0.3 pad 0.61)
  other vias: 5.08,60.96
N$29  (via drill 0.3 pad 0.61)
  other vias: 33.02,55.88
N$30  (via drill 0.3 pad 0.61)
  other vias: 7.62,55.88
N$31  (via drill 0.3 pad 0.61)
  other vias: 30.48,35.56
N$32  (via drill 0.3 pad 0.61)
  other vias: 12.7,20.32
N$33  (via drill 0.3 pad 0.61)
  other vias: 12.7,22.86
N$34  (via drill 0.3 pad 0.61)
  other vias: 33.02,5.08
RESET  (1 unrouted)
  Top 0.203: 12.65,48.69 12.55,48.59 12.55,44.3 10.41,42.16 9.95,41.69 9.95,40.8 C13.1 | 12.65,48.69 12.75,48.79 15.73,48.79 15.78,48.83 IC1.29 | 12.65,48.69 10.64,50.7 10.64,51.66 9.12,53.18 J2.3
  Top 0.305: J2.3 8.04,52.81 7.52,52.29 R1.2
RXD  (via drill 0.3 pad 0.61)  (1 unrouted)
  Top 0.203: R11.2 13.88,25.03 13.5,25.4 R10.1 12.6,26.4 12.42,26.4 v11.9,26.92 | IC1.30 15.21,48.27 15.15,48.2 v14.81,48.2 | J1.11 5.87,41.3 6.84,42.27 9.66,42.27 v11.37,43.98
  Bottom 0.203: v11.37,43.98 11.37,44.76 v14.81,48.2 | v11.9,26.92 11.9,31.91 J1.11
SCK  (via drill 0.3 pad 0.61)  (1 unrouted)
  Top 0.203: IC1.17 25.37,47.14 25.37,47.35 v25.55,47.53
  Bottom 0.203: CC1101-MODULE.SCLK 43.61,36.31 39.82,36.31 39.76,36.25 36.68,36.25 36.55,36.12 | J2.9 23.65,49.43 v25.55,47.53 25.55,47.12 36.55,36.12 | 36.55,36.12 29.56,29.13 28.68,29.13 27.86,28.31 27.86,27.94 RADIO.SCK
SCL  (via drill 0.3 pad 0.61)  (1 unrouted)
  Top 0.203: IC1.28 16.34,49.4 16.3,49.36 v15.16,49.36
  Bottom 0.203: J3.2 13.51,49.36 v15.16,49.36 15.38,49.13 15.38,46.22 15.12,45.95 15.12,40.57 17.4,38.29 17.4,37.46 18.18,36.69 18.18,32.14 26.5,23.82 30.53,23.82 37.18,17.18 49.8,17.18 51.31,15.67 51.31,10.16 SI7021.3 47.75,10.16 47.75,8.89 43.18,4.32 BMP180.3
SDA  (via drill 0.3 pad 0.61)  (1 unrouted)
  Top 0.203: 45.74,7.62 45.74,7.88 29.85,23.77 29.09,23.77 27.86,25 27.86,25.92 27.19,26.59 26.3,26.59 25,27.9 v25,28.55 | 45.74,7.62 47.75,7.62 SI7021.4 | 45.74,7.62 45.72,7.6 45.72,3.96 BMP180.4 | J3.1 16.23,50.64 IC1.27
  Bottom 0.203: v25,28.55 22.21,31.34 22.21,40.06 22.11,40.15 22.11,43.96 15.44,50.64 J3.1
TXD  (via drill 0.3 pad 0.61)  (1 unrouted)
  Top 0.203: J1.12 4.37,36.9 8.81,36.9 9.56,37.65 9.56,39.52 11.6,41.56 11.6,42.14 15.9,46.45 IC1.31 | IC8.4 10.69,31.59 6.98,35.3 v6.95,35.3
  Bottom 0.203: J1.12 5.97,35.3 v6.95,35.3
U-BAT  (via drill 0.3 pad 0.61)
  Top 0.203: R3.1 32.06,43.28 31.29,43.28 v31.09,43.49 | C6.2 3.26,43.97 2.78,43.49 | SV1.1 1.59,28.04 1.49,28.14 1.49,34.13 | SJ1.2 1.49,34.13 | 1.49,34.13 1.49,42.2 2.78,43.49 | J2.1 1.81,51.66 1.81,44.45 2.78,43.49
  Top 0.305: L1.1 4.29,44 C6.2
  Top 0.406: IC2.3 8.89,46.99 8.57,47.31 7.3,47.31 6.99,46.99 IC2.1 4.83,46.17 L1.1
  Bottom 0.203: J2.1 3.33,55.64 7.43,59.74 7.9,59.74 8.64,60.47 8.64,61.55 9.43,62.34 33.09,62.34 34.04,61.4 34.04,60.52 32.96,59.44 32.56,59.44 31.75,58.62 31.75,58.24 27.71,54.21 25.74,54.21 25.13,53.59 25.13,49.45 v31.09,43.49
VCC  (via drill 0.3 pad 0.61)
  Top 0.203: IC9.2 33.62,35.29 33.62,34.85 31.79,33.02 RADIO.VCC 28.02,33.02 28.02,32.12 27.72,31.83 25.08,31.83 23.21,29.96 v19.5,29.96
  Bottom 0.203: C9.+ 33.1,16.59 33.1,10.92 31.86,9.69 20.36,9.69 17.58,12.47 17.16,12.47 15.91,13.71 15.91,26.38 v19.5,29.96
VIN
  Top 0.203: 12.79,15.66 11.91,14.78 C15.+ 11.91,4.05 11.83,3.98 11.83,3.1 | OPT.6 21.83,61.99 14.76,61.99 13.72,60.95 13.72,60.48 12.93,59.69 7.44,59.69 0.51,52.76 0.51,26.56 3.71,23.36 7.93,23.36 8.37,22.92 8.37,21.29 9.34,20.32 9.46,20.32 10.27,19.51 10.27,18.43 12.74,15.96 | D1.C 11.83,3.1 | 11.83,3.1 12.7,3.1 13.26,2.54 C14.2 | 15.19,17.73 15.08,17.73
  Top 0.305: 15.08,17.73 14.52,17.73 12.74,15.96 | 12.74,15.96 | 12.74,15.96 12.74,15.7 12.79,15.66
  Top 0.406: 15.08,17.73 R7.2 | 15.3,17.62 15.19,17.73
  Top 0.61: IC6.6 15.3,17.62
XTAL1  (1 unrouted)
  Top 0.203: Q1.P$1 16.55,36.44 16.55,36.86 17.3,37.61 Q2.2 17.3,40.2 IC1.7
  Bottom 0.203: Q2.2 16.03,40.96 C3.1
XTAL2  (1 unrouted)
  Top 0.203: IC1.8 19.3,41.07 19.84,40.52 Q2.1 19.84,37.72 21.12,36.44 21.55,36.44 Q1.P$3
  Bottom 0.203: Q2.1 21.12,40.96 C4.1

### Text on the board
tNames: Universal-Sensor / CC1101 / RS485 / NRF24 | Rev 0.1, 05/2016 / www.neuby.de | RS485
bNames: CC1101-Module | + Bat | RS485-B | RS485-A | - Bat | RS485-GND | RS485 +24 V